# EAGLE schematic untitled (EAGLE 9.6.2)
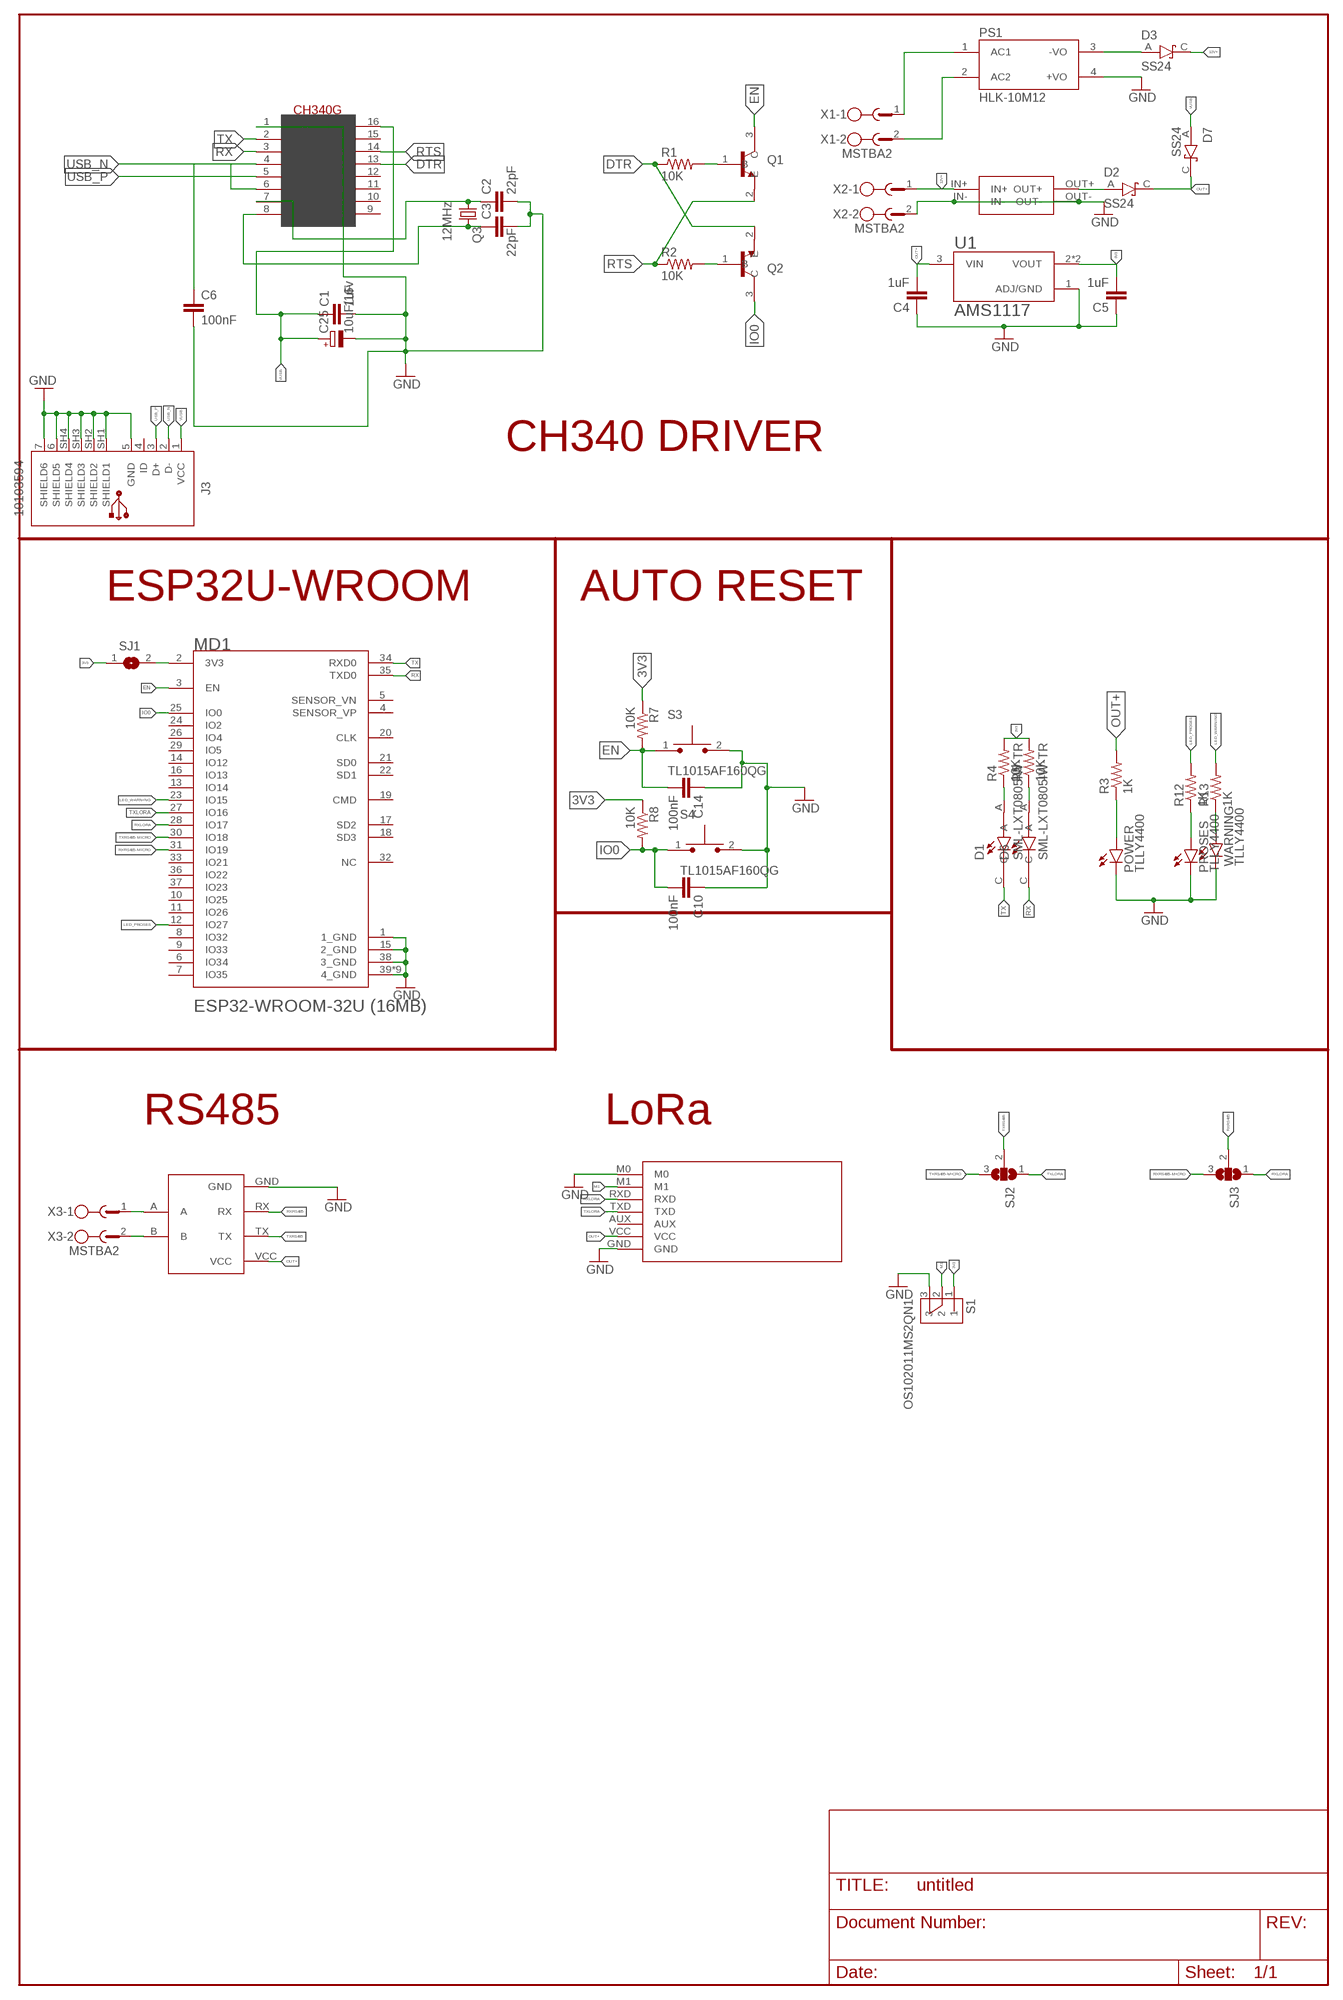
[diagram p0: schematic, sheet 1]

## Parts
C1  1uF  C-EUC0805K  [C0805K]
C2  22pF  C-EUC0805K  [C0805K]
C3  22pF  C-EUC0805K  [C0805K]
C4  1uF  C-EUC0805K  [C0805K]
C5  1uF  C-EUC0805K  [C0805K]
C6  100nF  C-EUC0805K  [C0805K]
C10  100nF  C-EUC0805K  [C0805K]
C14  100nF  C-EUC0805K  [C0805K]
C25  10uF/16v  CPOL-EU153CLV-0505  [153CLV-0505]
D1  SML-LXT0805IW-TR  [LEDC2012X120N]
D2  SS24  [DIOM5336X265N]
D3  SS24  [DIOM5336X265N]
D6  SML-LXT0805IW-TR  [LEDC2012X120N]
D7  SS24  [DIOM5336X265N]
EBYTEE220-900T22D1  EBYTEE220-900T22D  [EBYTEE220-900T22D]
J3  10103594  [10103594]
MD1  ESPRESSIF_SYSTEMS_ESP32-WROOM-32U_16MBESPRESSIF_SYSTEMS_ESP32-WROOM-32U_16MB_0_0  [ESPRESSIF_SYSTEMS_ESP32-WROOM-32U_16MB_0]
MINI1  MINI560  [MINI560]
POWER  TLLY4400  [LED3MM]
PROSES  TLLY4400  [LED3MM]
PS1  HLK-10M12  [CONV_HLK-10M12]
Q1  MMBT3904  [SOT95P240X120-3N]
Q2  MMBT3904  [SOT95P240X120-3N]
Q3  12MHz  CRYSTALSM49  [SM49]
R1  10K  R-US_M0805  [M0805]
R2  10K  R-US_M0805  [M0805]
R3  1K  R-US_M0805  [M0805]
R4  10K  R-US_M0805  [M0805]
R5  10K  R-US_M0805  [M0805]
R7  10K  R-US_M0805  [M0805]
R8  10K  R-US_M0805  [M0805]
R12  1K  R-US_M0805  [M0805]
R13  1K  R-US_M0805  [M0805]
S1  OS102011MS2QN1  [SW_OS102011MS2QN1]
S3  TL1015AF160QG  [SW_TL1015AF160QG]
S4  TL1015AF160QG  [SW_TL1015AF160QG]
SJ1  SJ  [SJ]
SJ2  SJ2W  [SJ_2]
SJ3  SJ2W  [SJ_2]
TTL-RS1  TTL-RS485  [TTL-RS485]
U1  AMS1117  [SOT229P700X180-4N]
U$2  CH340G  [SOIC16]
WARNING  TLLY4400  [LED3MM]
X1  MSTBA2  [MSTBA2]
X2  MSTBA2  [MSTBA2]
X3  MSTBA2  [MSTBA2]

## Nets
3V3: C5.2 R4.2 R5.2 R7.1 R8.1 S1.1 SJ1.1 U1.2(VOUT) U1.4(VOUT)
12V+: D3.C(K) MINI1.IN+ X2.1
DTR: Q2.2(E) R1.1 U$2.13(DTR)
EN: C14.2 MD1.3(EN) Q1.3(C) R7.2 S3.1
GND: C1.2 C2.2 C3.2 C4.1 C5.1 C6.2 C10.1 C14.1 C25.- EBYTEE220-900T22D1.GND EBYTEE220-900T22D1.M0 J3.5(GND) J3.6(SHIELD5) J3.7(SHIELD6) J3.SH1(SHIELD1) J3.SH2(SHIELD2) J3.SH3(SHIELD3) J3.SH4(SHIELD4) MD1.1(1_GND) MD1.15(2_GND) MD1.38(3_GND) MD1.39(4_GND) MD1.39-2(4_GND) MD1.39-3(4_GND) MD1.39-4(4_GND) MD1.39-5(4_GND) MD1.39-6(4_GND) MD1.39-7(4_GND) MD1.39-8(4_GND) MD1.39-9(4_GND) MINI1.IN- MINI1.OUT- POWER.K(C) PROSES.K(C) PS1.4(+VO) S1.3 S3.2 S4.2 TTL-RS1.GND U1.1(ADJ/GND) U$2.1(GND) WARNING.K(C) X2.2
IO0: C10.2 MD1.25(IO0) Q2.3(C) R8.2 S4.1
LED_PROSES: MD1.12(IO27) R12.2
LED_WARNING: MD1.23(IO15) R13.2
M1: EBYTEE220-900T22D1.M1 S1.2
N$1: C2.1 Q3.1 U$2.7(XI)
N$2: C3.1 Q3.2 U$2.8(XO)
N$3: POWER.A R3.1
N$4: Q1.1(B) R1.2
N$5: Q2.1(B) R2.2
N$6: PS1.1(AC1) X1.1
N$7: D3.A PS1.3(-VO)
N$8: D1.A R4.1
N$9: D6.A R5.1
N$10: TTL-RS1.A X3.1
N$11: D2.A MINI1.OUT+
N$12: C6.1 U$2.4(V3)
N$14: TTL-RS1.B X3.2
N$18: MD1.2(3V3) SJ1.2
N$25: PROSES.A R12.1
N$28: R13.1 WARNING.A
N$34: PS1.2(AC2) X1.2
OUT+: C4.2 D2.C(K) D7.C(K) EBYTEE220-900T22D1.VCC R3.2 TTL-RS1.VCC U1.3(VIN)
RTS: Q1.2(E) R2.1 U$2.14(RTS)
RX: D6.C MD1.35(TXD0) U$2.3(RX)
RXLORA: EBYTEE220-900T22D1.RXD MD1.28(IO17) SJ3.1
RXRS485: SJ3.2 TTL-RS1.RX
RXRS485-MICRO: MD1.31(IO19) SJ3.3
TX: D1.C MD1.34(RXD0) U$2.2(TX)
TXLORA: EBYTEE220-900T22D1.TXD MD1.27(IO16) SJ2.1
TXRS485: SJ2.2 TTL-RS1.TX
TXRS485-MICRO: MD1.30(IO18) SJ2.3
USB_N: J3.2(D-) U$2.6(D-)
USB_P: J3.3(D+) U$2.5(D+)
VUSB: C1.1 C25.+ D7.A J3.1(VCC) U$2.16(VCC)
Unconnected: EBYTEE220-900T22D1.AUX J3.4(ID) MD1.4(SENSOR_VP) MD1.5(SENSOR_VN) MD1.6(IO34) MD1.7(IO35) MD1.8(IO32) MD1.9(IO33) MD1.10(IO25) MD1.11(IO26) MD1.13(IO14) MD1.14(IO12) MD1.16(IO13) MD1.17(SD2) MD1.18(SD3) MD1.19(CMD) MD1.20(CLK) MD1.21(SD0) MD1.22(SD1) MD1.24(IO2) MD1.26(IO4) MD1.29(IO5) MD1.32(NC) MD1.33(IO21) MD1.36(IO22) MD1.37(IO23) U$2.9(CTS) U$2.10(DSR) U$2.11(RI) U$2.12(DCD) U$2.15(RS232)

## Notes on the sheet
- CH340 DRIVER
- ESP32U-WROOM | AUTO RESET
- RS485 | LoRa

## Library data of the parts
C1-C6 C10 C14 = rcl:C-EU: CAPACITOR, European symbol; SPICEPREFIX: C
C25 = rcl:CPOL-EU: POLARIZED CAPACITOR, European symbol; SPICEPREFIX: C
D1 D6 = SML-LXT0805IW-TR:SML-LXT0805IW-TR: LED; Luminous Intensity:11µcd; Viewing Angle:140°; Forward Current:30mA; Forward Voltage:2V; Color:Red; LED Color:Red; Leaded Process Compatible:Yes; Lens Color:White; Mounting Type:Surface Mount ;RoHS Compliant: Yes Check availability <https://pricing.snapeda.com/parts/SML-LXT0805IW-TR/Lumex%20Opto/Components/view-part?ref=eda>; AVAILABILITY: In Stock; DESCRIPTION: Red - LED Indication - Discrete 2V 0805 (2012 Metric); MF: Lumex Opto/Components; MP: SML-LXT0805IW-TR; PACKAGE: 0805 Lumex; PRICE: None; PURCHASE-URL: https://pricing.snapeda.com/search/part/SML-LXT0805IW-TR/?ref=eda
D2 D3 D7 = SS24:SS24: Diode Schottky 40V 2A Surface Mount DO-214AA (SMB) Check availability <https://pricing.snapeda.com/parts/SS24/ON%20Semiconductor/view-part?ref=eda>; AVAILABILITY: In Stock; CHECK_PRICES: https://www.snapeda.com/parts/SS24/Onsemi/view-part/?ref=eda; DESCRIPTION: Diode Schottky 40V 2A Surface Mount DO-214AA (SMB); MF: ON Semiconductor; MP: SS24; PACKAGE: DO-214AA ON Semiconductor; PRICE: None; SNAPEDA_LINK: https://www.snapeda.com/parts/SS24/Onsemi/view-part/?ref=snap
EBYTEE220-900T22D1 = EByte E220-900T22D:EBYTEE220-900T22D
J3 = Connector_USB:10103594: USB(2.0) Micro-B, RCPT, 5POS, SMD-THT-R/A Datasheet <https://cdn.amphenol-icc.com/media/wysiwyg/files/documentation/datasheet/inputoutput/io_usb_micro.pdf> Drawing <https://cdn.amphenol-icc.com/media/wysiwyg/files/drawing/10103594.pdf>; CATEGORY: Connectors; CONTACTS: 5; CURRENT-RATING: 1.8A; DESCRIPTION: CONN RCPT USB2.0 MICRO B SMD R/A; GENDER: Receptacle; MANUFACTURER: Amphenol ICC (FCI); MOUNT_TYPE: R/A; MPN: 10103594-0001LF; OPERATING_TEMPERATURE: -30°C ~ 80°C; PART_STATUS: ACTIVE; ROHS_COMPLIANT: COMPLIANT; SUB_CATEGORY: USB; TYPE: USB-micro B; VOLTAGE-RATING: 100VAC
MD1 = Espressif Systems - ESP32-WROOM-32U (16MB):ESPRESSIF_SYSTEMS_ESP32-WROOM-32U_16MB: Bluetooth, WiFi 802.11b/g/n, Bluetooth v4.2 +EDR, Class 1, 2 and 3 Transceiver Module 2.4GHz ~ 2.5GHz Antenna Not Included, U.FL Surface Mount; AUTOMOTIVE: No; BANDWIDTH: 72MHz; CENTROID_NOT_SPECIFIED: No; DATASHEET: https://www.espressif.com/sites/default/files/documentation/esp32-wroom-32d_esp32-wroom-32u_datasheet_en.pdf; DATA_RATE: 150Mbits/s; DEVICE_CLASS_L1: Integrated Circuits (ICs); DEVICE_CLASS_L2: RF Semiconductors and Devices; DEVICE_CLASS_L3: Transceivers; DIGIKEY_DESCRIPTION: RX TXRX MODULE WIFI U.FL SMD; DIGIKEY_PART_NUMBER: 1904-1028-1-ND; FOOTPRINT_VARIANT_NAME_0: Recommended_Land_Pattern; HEIGHT: 3.35mm; INTERFACE: I2C,SPI,UART,Ethernet,I2S,Other; LEAD_FREE: Yes; MAX_FREQUENCY: 2484MHz; MAX_SUPPLY_VOLTAGE: 3.6V; MF: Espressif Systems; MFG_PACKAGE_IDENT: 0; MFG_PACKAGE_IDENT_DATE: 0; MFG_PACKAGE_IDENT_REV: 0; MIN_SUPPLY_VOLTAGE: 3V; MOUSER_PART_NUMBER: 356-ES32WROOM32U16MB; MPN: ESP32-WROOM-32U (16MB); NOMINAL_SUPPLY_CURRENT: 0.5A; NUMBER_OF_ADC_CHANNELS: 16; NUMBER_OF_GPIO: 26; PACKAGE: BT_MODULE; PREFIX: MD; ROHS: Yes; SENSITIVITY: -98dBm; TEMPERATURE_RANGE_HIGH: +85°C; TEMPERATURE_RANGE_LOW: -40°C; VERIFICATION_VERSION: 0.0.0.3
MINI1 = MINI560:MINI560
POWER PROSES WARNING = led:TLLY4400: Low Current (2mA) LED 3 mm Tinted Diffused Package color YELLOW Source: Data sheet <http://www.farnell.com/datasheets/391098.pdf>; MF: VISHAY SEMICONDUCTOR; OC_FARNELL: 1612439
PS1 = HLK-10M12:HLK-10M12: Check availability <https://pricing.snapeda.com/parts/HLK-10M12/Hi-link/view-part?ref=eda>; AVAILABILITY: Not in stock; CHECK_PRICES: https://www.snapeda.com/parts/HLK-10M12/Hi-link/view-part/?ref=eda; DESCRIPTION: 10W Ultra-Compact Power Module; MF: Hi-link; MP: HLK-10M12; PACKAGE: Package; PRICE: None; SNAPEDA_LINK: https://www.snapeda.com/parts/HLK-10M12/Hi-link/view-part/?ref=snap
Q1 Q2 = MMBT3904:MMBT3904: MMBT3904 Series 40 V CE Breakdown 0.2 A NPN General Purpose Amplifier - SOT-23 Check availability <https://pricing.snapeda.com/parts/MMBT3904/STMicroelectronics/view-part?ref=eda>; AVAILABILITY: Not in stock; DESCRIPTION: SMD Transistor MMBT3904 SOT-23 SMD DIOTEC; MF: STMicroelectronics; MP: MMBT3904; PACKAGE: SOT-23 ON; PRICE: None
Q3 = adafruit:CRYSTAL: CRYSTAL; OC_FARNELL: unknown; OC_NEWARK: unknown
R1-R5 R7 R8 R12 R13 = adafruit:R-US_: RESISTOR, American symbol
S1 = OS102011MS2QN1:OS102011MS2QN1: Switch Slide ON ON SPDT Top Slide 0.1A 12VDC 10000Cycles PC Pins Thru-Hole Bulk Check availability <https://pricing.snapeda.com/parts/OS102011MS2QN1/C%26K/view-part?ref=eda>; AVAILABILITY: In Stock; CHECK_PRICES: https://www.snapeda.com/parts/OS102011MS2QN1/C%2526K/view-part/?ref=eda; DESCRIPTION: Switch,Slide,Mini,SPDT,ON-ON,Non-Shorting(BBM),100mA,12VDC,ThruHole,PC Pin | C&K OS102011MS2QN1; MF: C&K; MP: OS102011MS2QN1; PACKAGE: None; PRICE: None; SNAPEDA_LINK: https://www.snapeda.com/parts/OS102011MS2QN1/C%2526K/view-part/?ref=snap
S3 S4 = TL1015AF160QG:TL1015AF160QG: Tactile Switch SPST-NO Top Actuated Surface Mount Check availability <https://pricing.snapeda.com/parts/TL1015AF160QG/E-Switch/view-part?ref=eda>; AVAILABILITY: In Stock; DESCRIPTION: Tactile Switch SPST-NO Top Actuated Surface Mount; MF: E-Switch; MP: TL1015AF160QG; PACKAGE: None; PRICE: None; PURCHASE-URL: https://pricing.snapeda.com/search/part/TL1015AF160QG/?ref=eda
SJ1 = jumper:SJ: SMD solder JUMPER
SJ2 SJ3 = jumper:SJ2W: SMD solder JUMPER
TTL-RS1 = TTL-RS485:TTL-RS485
U1 = AMS1117:AMS1117: Sot223/Pkg 1-Amp 5-Volt Low Drop Out Voltage Regulatator Check availability <https://pricing.snapeda.com/parts/AMS1117/Advanced%20Monolithic%20Systems/view-part?ref=eda>; AVAILABILITY: Not in stock; DESCRIPTION: 1A LOW DROPOUT VOLTAGE REGULATOR SOT-223; MF: Advanced Monolithic Systems; MP: AMS1117; PACKAGE: SOT-223 Seeed Technology; PRICE: None
U$2 = usb-serial:CH340G
X1-X3 = con-phoenix-508:MSTBA2: PHOENIX; MF: FARNELL; MPN: 1757242; OC_FARNELL: 3705171; OC_NEWARK: 71C4161

## Net classes
0 default: width 0.2 mm, clearance 0.15 mm